# Altium schematic sheet Top Level.SchDoc
size A3; SheetNumber: 1; SheetTotal: 5
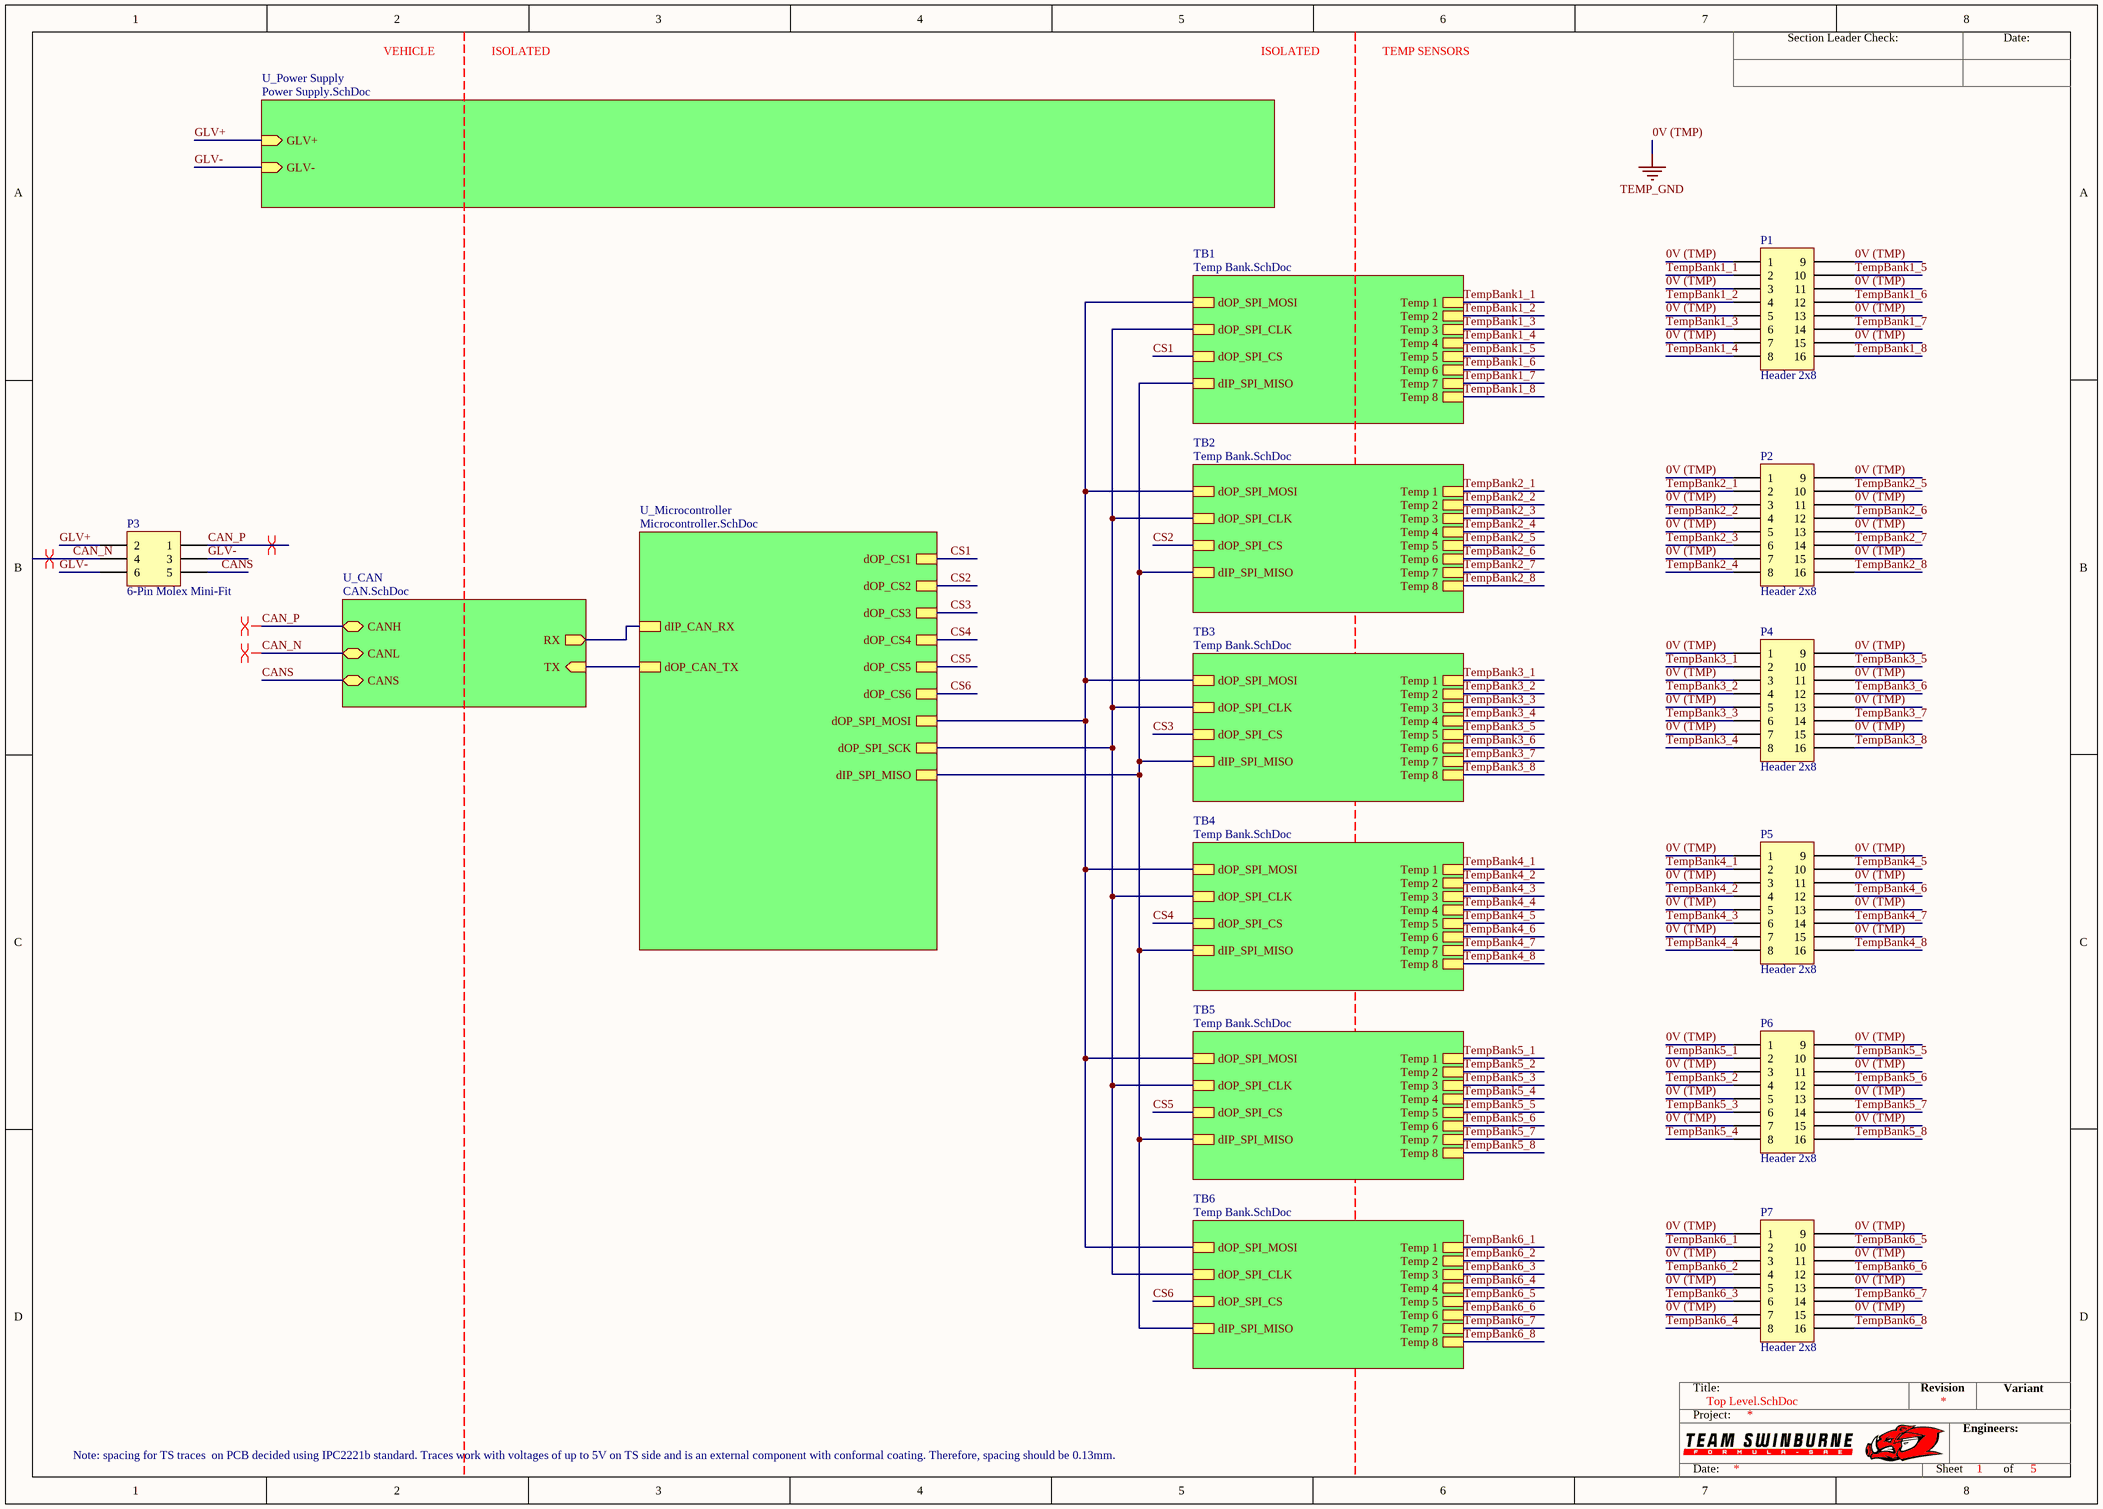
[diagram p0: Top Level.SchDoc]

## Parts
P1  Header 2x8  [B16B-PHDSS]
P2  Header 2x8  [B16B-PHDSS]
P3  6-Pin Molex Mini-Fit  [6-Pin Molex Mini-Fit]
P4  Header 2x8  [B16B-PHDSS]
P5  Header 2x8  [B16B-PHDSS]
P6  Header 2x8  [B16B-PHDSS]
P7  Header 2x8  [B16B-PHDSS]

## Sub-sheets
TB1 = Temp Bank.SchDoc: dOP_SPI_MOSI, dOP_SPI_CLK, dOP_SPI_CS, dIP_SPI_MISO, Temp 4, Temp 5, Temp 6, Temp 1, Temp 2, Temp 3, Temp 7, Temp 8
TB2 = Temp Bank.SchDoc: dOP_SPI_MOSI, dOP_SPI_CLK, dOP_SPI_CS, dIP_SPI_MISO, Temp 1, Temp 2, Temp 3, Temp 4, Temp 5, Temp 6, Temp 7, Temp 8
TB3 = Temp Bank.SchDoc: dOP_SPI_MOSI, dOP_SPI_CLK, dOP_SPI_CS, dIP_SPI_MISO, Temp 1, Temp 2, Temp 3, Temp 4, Temp 5, Temp 6, Temp 7, Temp 8
TB4 = Temp Bank.SchDoc: dOP_SPI_MOSI, dOP_SPI_CLK, dOP_SPI_CS, dIP_SPI_MISO, Temp 1, Temp 2, Temp 3, Temp 4, Temp 5, Temp 6, Temp 7, Temp 8
TB5 = Temp Bank.SchDoc: dOP_SPI_MOSI, dOP_SPI_CLK, dOP_SPI_CS, dIP_SPI_MISO, Temp 1, Temp 2, Temp 3, Temp 4, Temp 5, Temp 6, Temp 7, Temp 8
TB6 = Temp Bank.SchDoc: dOP_SPI_MOSI, dOP_SPI_CLK, dOP_SPI_CS, dIP_SPI_MISO, Temp 1, Temp 2, Temp 3, Temp 4, Temp 5, Temp 6, Temp 7, Temp 8
U_CAN = CAN.SchDoc: CANH (bidir), RX (out), TX (in), CANL (bidir), CANS (bidir)
U_Microcontroller = Microcontroller.SchDoc: dOP_CS1, dOP_CS2, dOP_CS3, dOP_CS4, dOP_CS5, dOP_SPI_MOSI, dOP_CS6, dOP_SPI_SCK, dIP_CAN_RX, dOP_CAN_TX, dIP_SPI_MISO
U_Power Supply = Power Supply.SchDoc: GLV+ (in), GLV- (in)

## Nets
0V (TMP): P1.1 P1.3 P1.5 P1.7 P1.9 P1.11 P1.13 P1.15 P2.1 P2.3 P2.5 P2.7 P2.9 P2.11 P2.13 P2.15 P4.1 P4.3 P4.5 P4.7 P4.9 P4.11 P4.13 P4.15 P5.1 P5.3 P5.5 P5.7 P5.9 P5.11 P5.13 P5.15 P6.1 P6.3 P6.5 P6.7 P6.9 P6.11 P6.13 P6.15 P7.1 P7.3 P7.5 P7.7 P7.9 P7.11 P7.13 P7.15  [also labelled TEMP_GND]
CAN_N: P3.4 ; sheet U_CAN/CANL
CAN_P: P3.1 ; sheet U_CAN/CANH
CANS: P3.5 ; sheet U_CAN/CANS
CS1: sheet U_Microcontroller/dOP_CS1, sheet TB1/dOP_SPI_CS
CS2: sheet U_Microcontroller/dOP_CS2, sheet TB2/dOP_SPI_CS
CS3: sheet U_Microcontroller/dOP_CS3, sheet TB3/dOP_SPI_CS
CS4: sheet U_Microcontroller/dOP_CS4, sheet TB4/dOP_SPI_CS
CS5: sheet U_Microcontroller/dOP_CS5, sheet TB5/dOP_SPI_CS
CS6: sheet U_Microcontroller/dOP_CS6, sheet TB6/dOP_SPI_CS
GLV+: P3.2 ; sheet U_Power Supply/GLV+
GLV-: P3.3 P3.6 ; sheet U_Power Supply/GLV-
TempBank1_1: P1.2 ; sheet TB1/Temp 1
TempBank1_2: P1.4 ; sheet TB1/Temp 2
TempBank1_3: P1.6 ; sheet TB1/Temp 3
TempBank1_4: P1.8 ; sheet TB1/Temp 4
TempBank1_5: P1.10 ; sheet TB1/Temp 5
TempBank1_6: P1.12 ; sheet TB1/Temp 6
TempBank1_7: P1.14 ; sheet TB1/Temp 7
TempBank1_8: P1.16 ; sheet TB1/Temp 8
TempBank2_1: P2.2 ; sheet TB2/Temp 1
TempBank2_2: P2.4 ; sheet TB2/Temp 2
TempBank2_3: P2.6 ; sheet TB2/Temp 3
TempBank2_4: P2.8 ; sheet TB2/Temp 4
TempBank2_5: P2.10 ; sheet TB2/Temp 5
TempBank2_6: P2.12 ; sheet TB2/Temp 6
TempBank2_7: P2.14 ; sheet TB2/Temp 7
TempBank2_8: P2.16 ; sheet TB2/Temp 8
TempBank3_1: P4.2 ; sheet TB3/Temp 1
TempBank3_2: P4.4 ; sheet TB3/Temp 2
TempBank3_3: P4.6 ; sheet TB3/Temp 3
TempBank3_4: P4.8 ; sheet TB3/Temp 4
TempBank3_5: P4.10 ; sheet TB3/Temp 5
TempBank3_6: P4.12 ; sheet TB3/Temp 6
TempBank3_7: P4.14 ; sheet TB3/Temp 7
TempBank3_8: P4.16 ; sheet TB3/Temp 8
TempBank4_1: P5.2 ; sheet TB4/Temp 1
TempBank4_2: P5.4 ; sheet TB4/Temp 2
TempBank4_3: P5.6 ; sheet TB4/Temp 3
TempBank4_4: P5.8 ; sheet TB4/Temp 4
TempBank4_5: P5.10 ; sheet TB4/Temp 5
TempBank4_6: P5.12 ; sheet TB4/Temp 6
TempBank4_7: P5.14 ; sheet TB4/Temp 7
TempBank4_8: P5.16 ; sheet TB4/Temp 8
TempBank5_1: P6.2 ; sheet TB5/Temp 1
TempBank5_2: P6.4 ; sheet TB5/Temp 2
TempBank5_3: P6.6 ; sheet TB5/Temp 3
TempBank5_4: P6.8 ; sheet TB5/Temp 4
TempBank5_5: P6.10 ; sheet TB5/Temp 5
TempBank5_6: P6.12 ; sheet TB5/Temp 6
TempBank5_7: P6.14 ; sheet TB5/Temp 7
TempBank5_8: P6.16 ; sheet TB5/Temp 8
TempBank6_1: P7.2 ; sheet TB6/Temp 1
TempBank6_2: P7.4 ; sheet TB6/Temp 2
TempBank6_3: P7.6 ; sheet TB6/Temp 3
TempBank6_4: P7.8 ; sheet TB6/Temp 4
TempBank6_5: P7.10 ; sheet TB6/Temp 5
TempBank6_6: P7.12 ; sheet TB6/Temp 6
TempBank6_7: P7.14 ; sheet TB6/Temp 7
TempBank6_8: P7.16 ; sheet TB6/Temp 8
(unnamed): sheet U_CAN/RX, sheet U_Microcontroller/dIP_CAN_RX
(unnamed): sheet U_CAN/TX, sheet U_Microcontroller/dOP_CAN_TX
(unnamed): sheet U_Microcontroller/dOP_SPI_MOSI, sheet TB1/dOP_SPI_MOSI, sheet TB2/dOP_SPI_MOSI, sheet TB3/dOP_SPI_MOSI, sheet TB4/dOP_SPI_MOSI, sheet TB5/dOP_SPI_MOSI, sheet TB6/dOP_SPI_MOSI
(unnamed): sheet U_Microcontroller/dOP_SPI_SCK, sheet TB1/dOP_SPI_CLK, sheet TB2/dOP_SPI_CLK, sheet TB3/dOP_SPI_CLK, sheet TB4/dOP_SPI_CLK, sheet TB5/dOP_SPI_CLK, sheet TB6/dOP_SPI_CLK
(unnamed): sheet U_Microcontroller/dIP_SPI_MISO, sheet TB1/dIP_SPI_MISO, sheet TB2/dIP_SPI_MISO, sheet TB3/dIP_SPI_MISO, sheet TB4/dIP_SPI_MISO, sheet TB5/dIP_SPI_MISO, sheet TB6/dIP_SPI_MISO

## Layout directives
differential pair: CAN_N, CAN_P

## Notes on the sheet
- VEHICLE
- ISOLATED
- TEMP SENSORS
- Note: spacing for TS traces  on PCB decided using IPC2221b standard. Traces work with voltages of up to 5V on TS side and is an external component with conformal coating. Therefore, spacing should be 0.13mm.
- Section Leader Check:
- Date:
- Title:
- Revision
- Variant
- Project:
- Engineers:
- Sheet
- of

## Library data of the parts
P1 P2 P4-P7 = B16B-PHDSS: Positions: 16; Pitch: 2.00mm; Angle: 0; Flange: No; Contact: Tin; Part Number: B16B-PHDSS; Row Spacing: 2.00mm
P3 = CMP-CONN-0004-1: 6-Pin Molex Mini-Fit Connector Header 6 pin mini fit